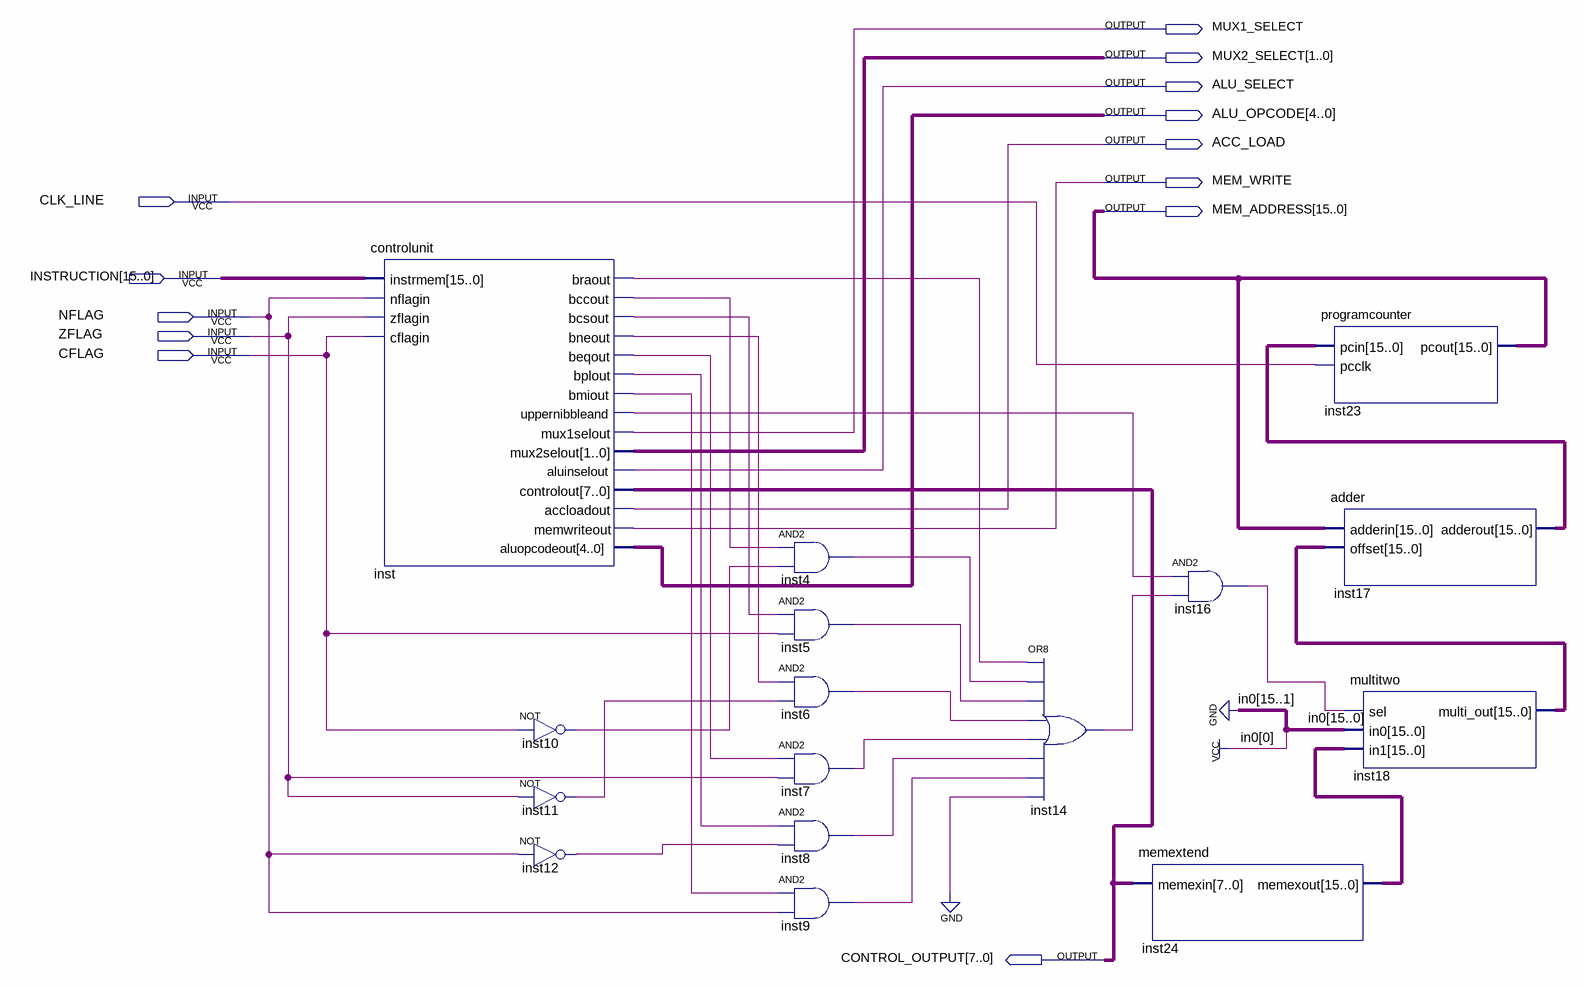
[diagram p0: schematic sheet]
// Quartus schematic completecontrolunit.bdf as structural Verilog: 16 symbols, 13 pins
module completecontrolunit (
  input  CLK_LINE,
  input  [15:0] INSTRUCTION,
  input  NFLAG,
  input  ZFLAG,
  input  CFLAG,
  output MUX1_SELECT,
  output [1:0] MUX2_SELECT,
  output ALU_SELECT,
  output [4:0] ALU_OPCODE,
  output ACC_LOAD,
  output MEM_WRITE,
  output [15:0] MEM_ADDRESS,
  output [7:0] CONTROL_OUTPUT
);

  wire inst4_out, inst5_out, inst6_out, inst7_out, inst8_out, inst9_out, inst10_out, inst11_out, inst12_out,
       inst14_out, inst16_out, inst_bccout, inst_bcsout, inst_beqout, inst_bmiout, inst_bneout, inst_bplout,
       inst_braout, inst_uppernibbleand;
  wire [15:0] inst17_adderout, inst18_multi_out, inst24_memexout;

  controlunit inst (
    .instrmem(INSTRUCTION), .nflagin(NFLAG), .zflagin(ZFLAG), .cflagin(CFLAG), .braout(inst_braout),
    .bccout(inst_bccout), .bcsout(inst_bcsout), .bneout(inst_bneout), .beqout(inst_beqout),
    .bplout(inst_bplout), .bmiout(inst_bmiout), .uppernibbleand(inst_uppernibbleand),
    .mux1selout(MUX1_SELECT), .mux2selout(MUX2_SELECT), .aluinselout(ALU_SELECT),
    .controlout(CONTROL_OUTPUT), .accloadout(ACC_LOAD), .memwriteout(MEM_WRITE), .aluopcodeout(ALU_OPCODE));
  not inst10 (inst10_out, CFLAG);
  not inst11 (inst11_out, ZFLAG);
  not inst12 (inst12_out, NFLAG);
  and inst4 (inst4_out, inst_bccout, inst10_out);
  and inst5 (inst5_out, inst_bcsout, CFLAG);
  and inst6 (inst6_out, inst_bneout, inst11_out);
  and inst7 (inst7_out, inst_beqout, ZFLAG);
  and inst8 (inst8_out, inst_bplout, inst12_out);
  and inst9 (inst9_out, inst_bmiout, NFLAG);
  or inst14 (inst14_out, inst_braout, inst4_out, inst5_out, inst6_out, inst7_out, inst8_out, inst9_out, 1'b0);
  memextend inst24 (.memexin(CONTROL_OUTPUT), .memexout(inst24_memexout));
  and inst16 (inst16_out, inst_uppernibbleand, inst14_out);
  programcounter inst23 (.pcin(inst17_adderout), .pcclk(CLK_LINE), .pcout(MEM_ADDRESS));
  adder inst17 (.adderin(MEM_ADDRESS), .offset(inst18_multi_out), .adderout(inst17_adderout));
  multitwo inst18 (.sel(inst16_out), .in0(16'b0000000000000001), .in1(inst24_memexout), .multi_out(inst18_multi_out));
endmodule
